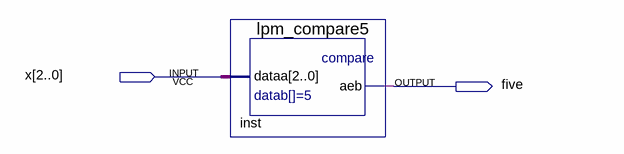
[diagram p0: schematic sheet]
// Quartus schematic fiveDetector.bdf as structural Verilog: 1 symbols, 2 pins
module fiveDetector (
  input  [2:0] x,
  output five
);

  lpm_compare5 inst (.dataa(x), .aeb(five));
endmodule
